# Altium schematic sheet A9G_AHRS.SchDoc
size A4
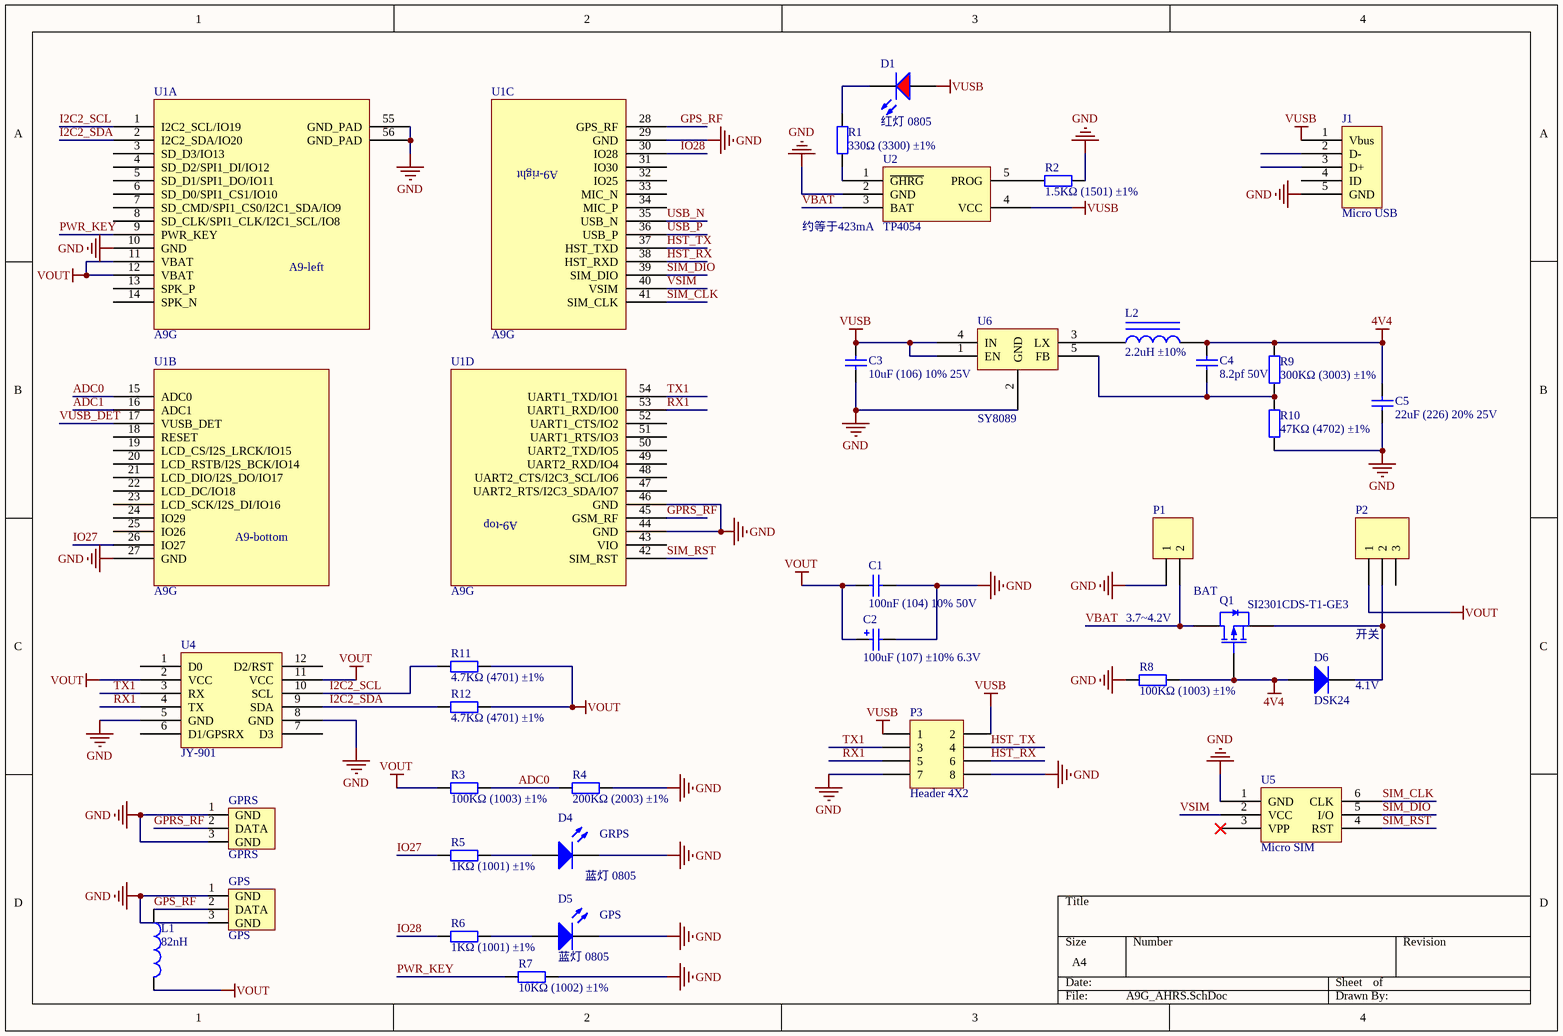
[diagram p0: A9G_AHRS.SchDoc]

## Parts
C1  100nF (104) 10% 50V  [LC-0603_C]
C2  100uF (107) ±10% 6.3V  [LC-CASE-B_3528]
C3  10uF (106) 10% 25V  [LC-0805_C]
C4  8.2pf 50V  [LC-0805_C]
C5  22uF (226) 20% 25V  [LC-0805_C]
D1  红灯 0805  [LC-0805_LED_S1]
D4  蓝灯 0805  [LC-0805_LED_S1]
D5  蓝灯 0805  [LC-0805_LED_S1]
D6  DSK24  [LC-SOD-123]
GPRS  GPRS  [IPEX]
GPS  GPS  [IPEX]
J1  Micro USB  [Micro USB]
L1  82nH  [LC-0805_L]
L2  2.2uH ±10%  [3015]
P1  BAT  [Motor_Header]
P2  开关  [SW_6726]
P3  Header 4X2  [HDR2X4]
Q1  SI2301CDS-T1-GE3  [LC-SOT-23(SOT-23-3)]
R1  330Ω (3300) ±1%  [LC-0805_R]
R2  1.5KΩ (1501) ±1%  [LC-0805_R]
R3  100KΩ (1003) ±1%  [LC-0805_R]
R4  200KΩ (2003) ±1%  [LC-0805_R]
R5  1KΩ (1001) ±1%  [LC-0805_R]
R6  1KΩ (1001) ±1%  [LC-0805_R]
R7  10KΩ (1002) ±1%  [LC-0805_R]
R8  100KΩ (1003) ±1%  [LC-0805_R]
R9  300KΩ (3003) ±1%  [LC-0805_R]
R10  47KΩ (4702) ±1%  [LC-0805_R]
R11  4.7KΩ (4701) ±1%  [LC-0805_R]
R12  4.7KΩ (4701) ±1%  [LC-0805_R]
U1  A9G  [A9]  (parts A,B,C,D of 4)
U2  TP4054  [LC-SOT-23-5]
U4  JY-901  [JY-901]
U5  Micro SIM  [Micro SIM]
U6  SY8089  [LC-SOT-23-5]

## Nets
4V4: C4.2 C5.2 D6.1(A) L2.2 Q1.1(G) R8.2 R9.2
GND: C1.2 C2.2 C3.1 C5.1 D4.K D5.K GPRS.1(GND) GPRS.3(GND) GPS.1(GND) GPS.3(GND) J1.5(GND) P1.1 P3.7 P3.8 R2.2 R4.2 R7.2 R8.1 R10.1 U1.10(GND) U1.27(GND) U1.29(GND) U1.44(GND) U1.46(GND) U1.55(GND_PAD) U1.56(GND_PAD) U2.2(GND) U4.5(GND) U4.8(GND) U5.1(GND) U6.2(GND)
VOUT: C1.1 C2.1 L1.2 P2.1 R3.1 R11.2 R12.2 U1.11(VBAT) U1.12(VBAT) U4.2(VCC) U4.11(VCC)
VUSB: C3.2 D1.A J1.1(Vbus) P3.1 P3.2 U2.4(VCC) U6.1(EN) U6.4(IN)
ADC0: R3.2 R4.1 U1.15(ADC0)
ADC1: U1.16(ADC1)
GPRS_RF: GPRS.2(DATA) U1.45(GSM_RF)
GPS_RF: GPS.2(DATA) L1.1 U1.28(GPS_RF)
HST_RX: P3.6 U1.38(HST_RXD)
HST_TX: P3.4 U1.37(HST_TXD)
I2C2_SCL: R11.1 U1.1(I2C2_SCL/IO19) U4.10(SCL)
I2C2_SDA: R12.1 U1.2(I2C2_SDA/IO20) U4.9(SDA)
IO27: R5.1 U1.26(IO27)
IO28: R6.1 U1.30(IO28)
PWR_KEY: R7.1 U1.9(PWR_KEY)
RX1: P3.5 U1.53(UART1_RXD/IO0) U4.4(TX)
SIM_CLK: U1.41(SIM_CLK) U5.6(CLK)
SIM_DIO: U1.39(SIM_DIO) U5.5(I/O)
SIM_RST: U1.42(SIM_RST) U5.4(RST)
TX1: P3.3 U1.54(UART1_TXD/IO1) U4.3(RX)
USB_N: U1.35(USB_N)
USB_P: U1.36(USB_P)
VBAT: P1.2 Q1.3(D) U2.3(BAT)
VSIM: U1.40(VSIM) U5.2(VCC)
VUSB_DET: U1.17(VUSB_DET)
NetC4_1: C4.1 R9.1 R10.2 U6.5(FB)
NetD1_K: D1.K R1.2
NetD4_A: D4.A R5.2
NetD5_A: D5.A R6.2
NetD6_2: D6.2(K) P2.2 Q1.2(S)
NetL2_1: L2.1 U6.3(LX)
NetR1_1: R1.1 U2.1(~{GHRG})
NetR2_1: R2.1 U2.5(PROG)

Not connected (* = marked no-connect by the designer): J1 2(D-) 3(D+) 4(ID); P2 3; U1 3(SD_D3/IO13) 4(SD_D2/SPI1_DI/IO12) 5(SD_D1/SPI1_DO/IO11) 6(SD_D0/SPI1_CS1/IO10) 7(SD_CMD/SPI1_CS0/I2C1_SDA/IO9) 8(SD_CLK/SPI1_CLK/I2C1_SCL/IO8) 13(SPK_P) 14(SPK_N) 18(RESET) 19(LCD_CS/I2S_LRCK/IO15) 20(LCD_RSTB/I2S_BCK/IO14) 21(LCD_DIO/I2S_DO/IO17) 22(LCD_DC/IO18) 23(LCD_SCK/I2S_DI/IO16) 24(IO29) 25(IO26) 31(IO30) 32(IO25) 33(MIC_N) 34(MIC_P) 43(VIO) 47(UART2_RTS/I2C3_SDA/IO7) 48(UART2_CTS/I2C3_SCL/IO6) 49(UART2_RXD/IO4) 50(UART2_TXD/IO5) 51(UART1_RTS/IO3) 52(UART1_CTS/IO2); U4 1(D0) 6(D1/GPSRX) 7(D3) 12(D2/RST); U5 3(VPP)*

## Notes on the sheet
- (near U2) 约等于423mA
- 3.7~4.2V
- (near D6) 4.1V
- GRPS
- (near D5) GPS
- (in symbol A9, part A) A9-left
- (in symbol A9, part B) A9-bottom
- (in symbol A9, part C) A9-right
- (in symbol A9, part D) A9-top

## Library data of the parts
C1 = 0603 100nF (104) 10% 50V: 贴片电容; ComponentLink1Description: 供应商链接; ComponentLink1URL: http://www.szlcsc.com/product/details_15331.html; Package: 0603; Supplier: LC; SuppliersPartNumber: C14663
C2 = 3528 100uF (107) 10% 6.3V: 钽电容; ComponentLink1Description: 供应商链接; ComponentLink1URL: http://www.szlcsc.com/product/details_16815.html; Package: 3528; Supplier: LC; SuppliersPartNumber: C16133
C3 = 0805 10uF (106) 10% 25V: 贴片电容; ComponentLink1Description: 供应商链接; ComponentLink1URL: http://www.szlcsc.com/product/details_16532.html; Package: 0805; Supplier: LC; SuppliersPartNumber: C15850
C4 = 0805 100nF(104) 10% 50V: 贴片电容; ComponentLink1Description: 供应商链接; ComponentLink1URL: http://www.szlcsc.com/product/details_50686.html; Package: 0805; Supplier: LC; SuppliersPartNumber: C49678
C5 = 0805 22uF (226) 20% 25V: 贴片电容; ComponentLink1Description: 供应商链接; ComponentLink1URL: http://www.szlcsc.com/product/details_46786.html; Package: 0805; Supplier: LC; SuppliersPartNumber: C45783
D1 = 0805 红灯: 发光二极管; ComponentLink1Description: 供应商链接; ComponentLink1URL: http://www.szlcsc.com/product/details_2668.html; Package: 0805; Supplier: LC; SuppliersPartNumber: C2295
D4 D5 = 0805 蓝灯: 发光二极管; ComponentLink1Description: 供应商链接; ComponentLink1URL: http://www.szlcsc.com/product/details_2666.html; Package: 0805; Supplier: LC; SuppliersPartNumber: C2293
D6 = SOD-123 B5819W  SL: 肖特基二极管; VF: 0.1A/0.31V, 2A/0.47V, 0A/0.25V; ComponentLink1Description: 供应商链接; ComponentLink1URL: http://www.szlcsc.com/product/details_9093.html; Package: SOD-123; Supplier: LC; SuppliersPartNumber: C8598
GPRS GPS = IPEX: IPEX座
J1 = Micro USB: micro usb 母座
L1 = Inductor: Code_IEC: 1005; Published: 8-Jun-2000; LatestRevisionDate: 29-May-2009; LatestRevisionNote: IPC-7351 Footprint Added.; PackageReference: 0402-A; Publisher: Altium Limited; PackageDescription: Chip Inductor; Code_JEITA: 0402; Value: 82nH
L2 = 0805 2.2uH 10%: 贴片电感; ComponentLink1URL: http://www.szlcsc.com/product/details_1395.html; Package: 0805; Supplier: LC; SuppliersPartNumber: C1043
P1 = Header 2: Header, 2-Pin; LatestRevisionDate: 17-Jul-2002; LatestRevisionNote: Re-released for DXP Platform.; Publisher: Altium Limited
P2 = Header 3H: Header, 3-Pin, Right Angle; LatestRevisionDate: 17-Jul-2002; LatestRevisionNote: Re-released for DXP Platform.; Publisher: Altium Limited
P3 = Header 4X2: Header, 4-Pin, Dual row; LatestRevisionDate: 17-Jul-2002; LatestRevisionNote: Re-released for DXP Platform.; Publisher: Altium Limited
Q1 = SI2301CDS-T1-GE3: MOS(场效应管); ComponentLink1Description: 供应商链接; ComponentLink1URL: http://www.szlcsc.com/product/details_11030.html; Package: SOT-23(SOT-23-3); Supplier: LC; SuppliersPartNumber: C10487
R1 = 0805 330Ω (3300) 1%: 贴片电阻; ComponentLink1Description: 供应商链接; ComponentLink1URL: http://www.szlcsc.com/product/details_18318.html; Package: 0805; Supplier: LC; SuppliersPartNumber: C17630
R2 = 0805 1.5KΩ (1501) 1%: 贴片电阻; ComponentLink1Description: 供应商链接; ComponentLink1URL: http://www.szlcsc.com/product/details_4717.html; Package: 0805; Supplier: LC; SuppliersPartNumber: C4310
R3 R8 = 0805 100KΩ (1003) 1%: 贴片电阻; ComponentLink1Description: 供应商链接; ComponentLink1URL: http://www.szlcsc.com/product/details_18095.html; Package: 0805; Supplier: LC; SuppliersPartNumber: C17407
R4 = 0805 200KΩ (2003) 1%: 贴片电阻; ComponentLink1Description: 供应商链接; ComponentLink1URL: http://www.szlcsc.com/product/details_18227.html; Package: 0805; Supplier: LC; SuppliersPartNumber: C17539
R5 R6 = 0805 1KΩ (1001) 1%: 贴片电阻; ComponentLink1Description: 供应商链接; ComponentLink1URL: http://www.szlcsc.com/product/details_18201.html; Package: 0805; Supplier: LC; SuppliersPartNumber: C17513
R7 = 0805 10KΩ (1002) 1%: 贴片电阻; ComponentLink1Description: 供应商链接; ComponentLink1URL: http://www.szlcsc.com/product/details_18102.html; Package: 0805; Supplier: LC; SuppliersPartNumber: C17414
R9 = 0805 300KΩ (3003) 1%: 贴片电阻; ComponentLink1Description: 供应商链接; ComponentLink1URL: http://www.szlcsc.com/product/details_18304.html; Package: 0805; Supplier: LC; SuppliersPartNumber: C17616
R10 = 0805 47KΩ (4702) 1%: 贴片电阻; ComponentLink1Description: 供应商链接; ComponentLink1URL: http://www.szlcsc.com/product/details_18401.html; Package: 0805; Supplier: LC; SuppliersPartNumber: C17713
R11 R12 = 0805 4.7KΩ (4701) 1%: 贴片电阻; ComponentLink1Description: 供应商链接; ComponentLink1URL: http://www.szlcsc.com/product/details_18361.html; Package: 0805; Supplier: LC; SuppliersPartNumber: C17673
U1 = A9
U2 = TP4054: 电池电源管理; ComponentLink1Description: 供应商链接; ComponentLink1URL: http://www.szlcsc.com/product/details_33539.html; Package: SOT-23-5; Supplier: LC; SuppliersPartNumber: C32574
U4 = JY-901: 君悦智控高精度9轴传感器
U6 = SY8089: DC-DC regulator IC  capable of delivering up to 2A output current.